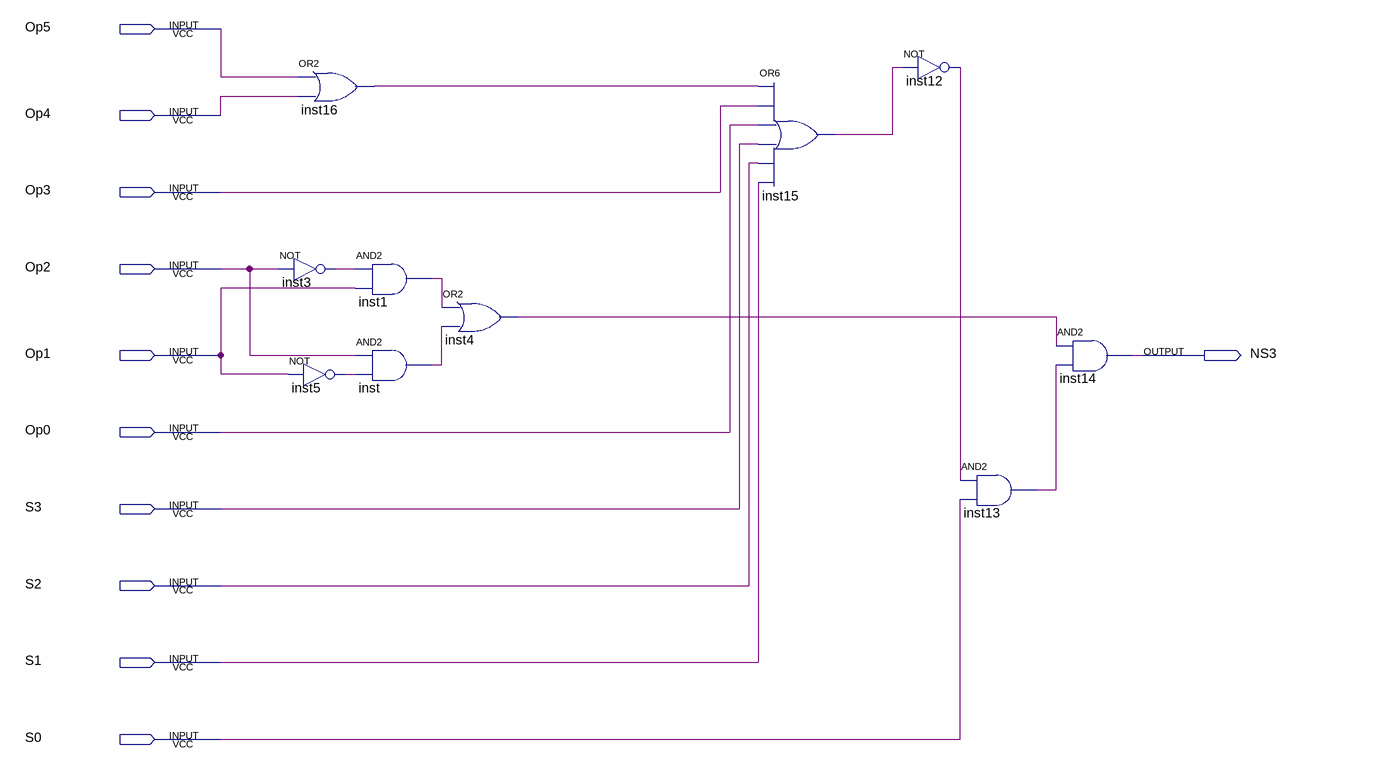
[diagram p0: schematic sheet]
// Quartus schematic NS3.bdf as structural Verilog: 10 symbols, 11 pins
module NS3 (
  input  Op5,
  input  Op4,
  input  Op3,
  input  Op2,
  input  Op1,
  input  Op0,
  input  S3,
  input  S2,
  input  S1,
  input  S0,
  output NS3
);

  wire inst1_out, inst3_out, inst4_out, inst5_out, inst12_out, inst13_out, inst15_out, inst16_out, inst_out;

  or inst16 (inst16_out, Op5, Op4);
  not inst3 (inst3_out, Op2);
  not inst5 (inst5_out, Op1);
  and inst1 (inst1_out, inst3_out, Op1);
  and inst (inst_out, Op2, inst5_out);
  or inst4 (inst4_out, inst1_out, inst_out);
  or inst15 (inst15_out, inst16_out, Op3, Op0, S3, S2, S1);
  not inst12 (inst12_out, inst15_out);
  and inst13 (inst13_out, inst12_out, S0);
  and inst14 (NS3, inst4_out, inst13_out);
endmodule
